# EAGLE design Thermostat (EAGLE 9.6.2)
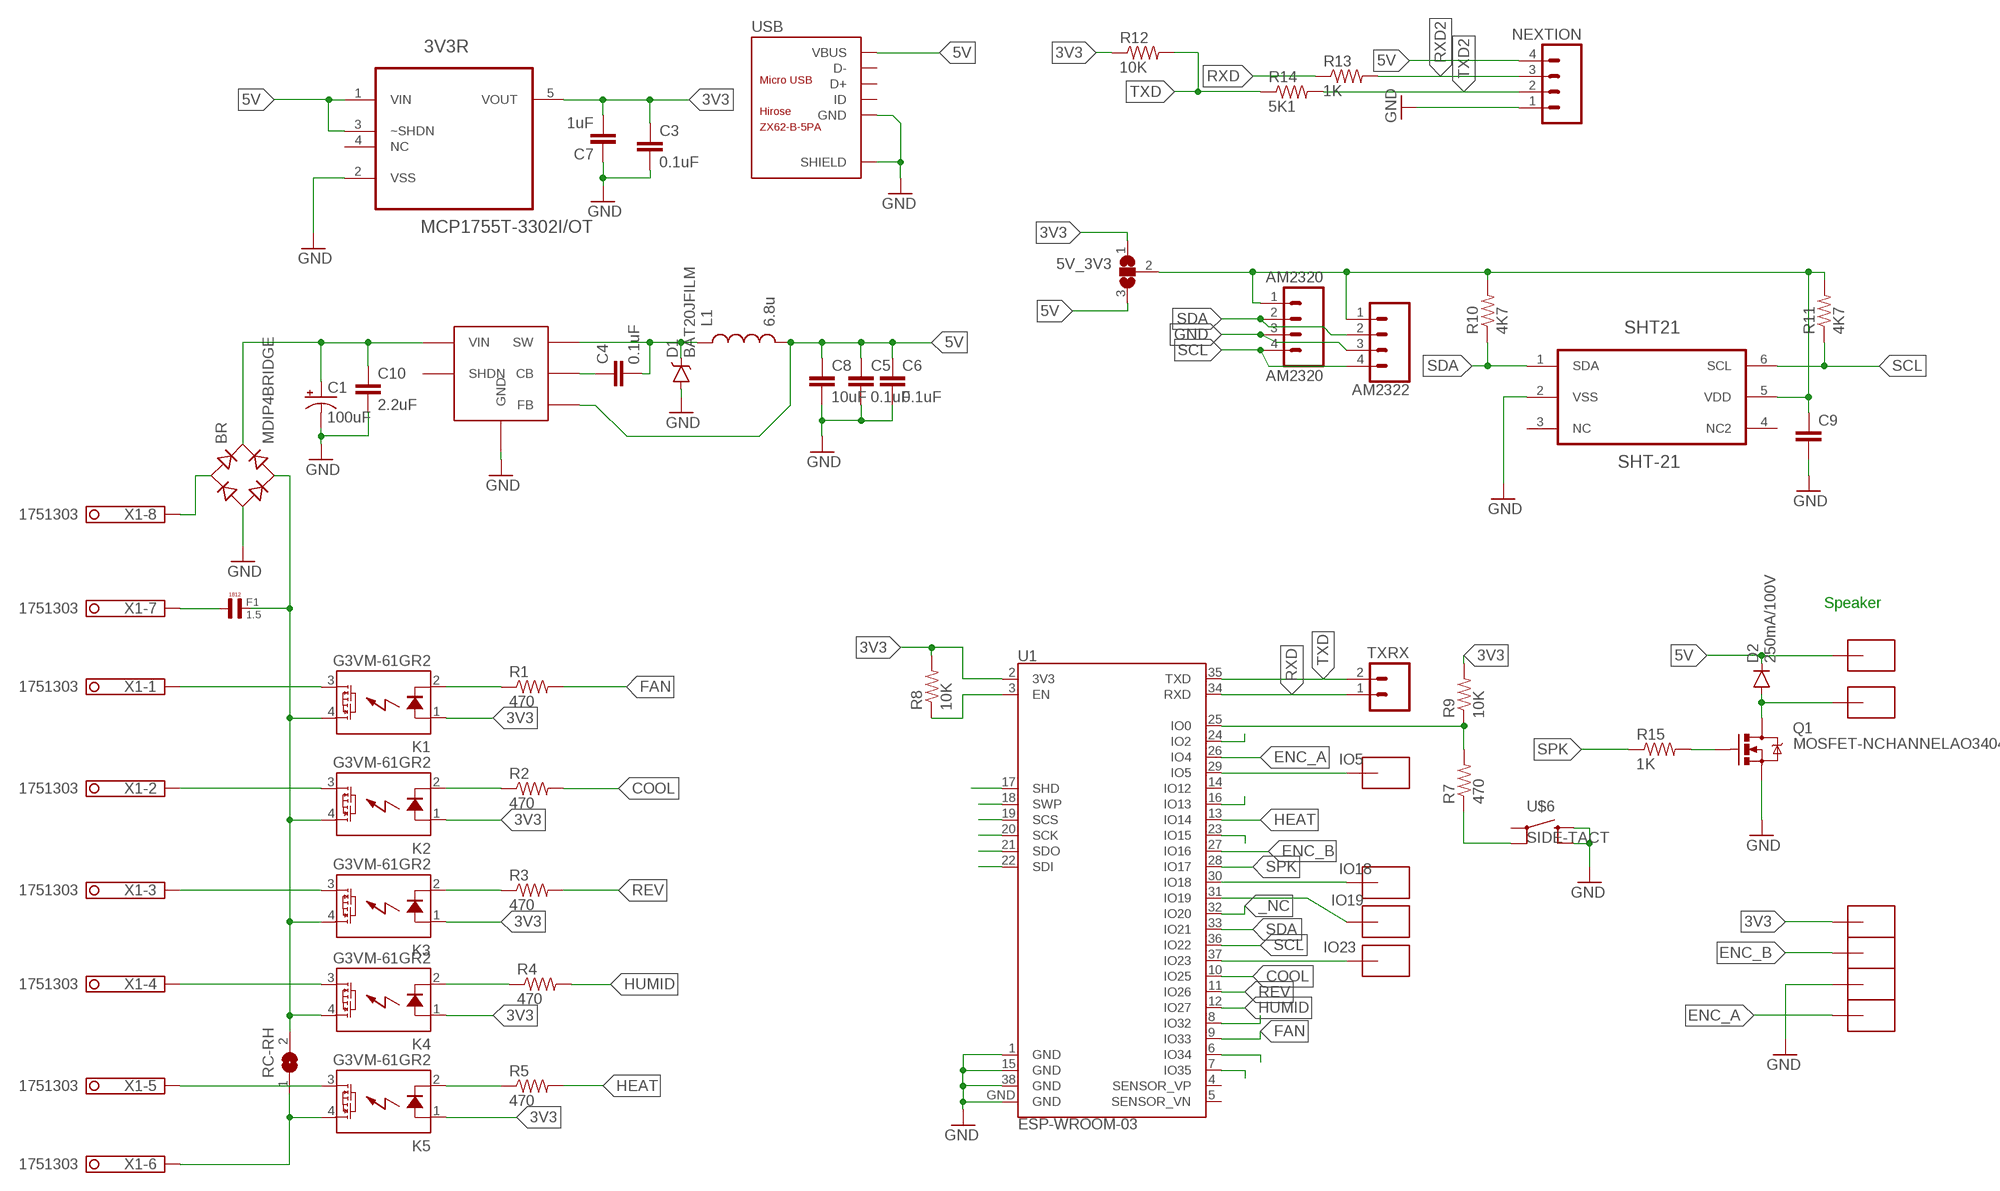
[diagram p0: schematic, sheet 1]

## Parts
3V3R  MCP1755T-3302I/OT  MCP1801T-3302I/OT  [SOT95P270X145-5N]
5V_3V3  SJ2W  [SJ_2]
AM2320  AM2320  M04PTH  [1X04]
AM2322  CONN_041.27MM  [1X04_1.27MM]
BR  MDIP4BRIDGE  [MICRODIP4]
C1  100uF  CAP_POLC  [PANASONIC_C]
C3  0.1uF  CAP0805  [0805]
C4  0.1uF  CAP0805  [0805]
C5  0.1uF  CAP0805  [0805]
C6  0.1uF  CAP0805  [0805]
C7  1uF  CAP0805  [0805]
C8  10uF  CAP0805  [0805]
C9  CAP0603-CAP  [0603-CAP]
C10  2.2uF  CAP0805  [0805]
D1  BAT20JFILM  [SOD-323]
D2  250mA/100V  DIODEBAS16  [SOD-323]
F1  1.5  0,1µF  [L4,8]
K1  G3VM-61GR2  AQY22SOP  [SOP04]
K2  G3VM-61GR2  AQY22SOP  [SOP04]
K3  G3VM-61GR2  AQY22SOP  [SOP04]
K4  G3VM-61GR2  AQY22SOP  [SOP04]
K5  G3VM-61GR2  AQY22SOP  [SOP04]
L1  6.8u  INDUCTOR1007  [1007]
NEXTION  M04PTH  [1X04]
Q1  MOSFET-NCHANNELAO3404A  [SOT23-3]
R1  470  RESISTOR0805-RES  [0805]
R2  470  RESISTOR0805-RES  [0805]
R3  470  RESISTOR0805-RES  [0805]
R4  470  RESISTOR0805-RES  [0805]
R5  470  RESISTOR0805-RES  [0805]
R7  470  RESISTOR0805-RES  [0805]
R8  10K  RESISTOR0805-RES  [0805]
R9  10K  RESISTOR0805-RES  [0805]
R10  4K7  RESISTOR0805-RES  [0805]
R11  4K7  RESISTOR0805-RES  [0805]
R12  10K  RESISTOR0805-RES  [0805]
R13  1K  RESISTOR0805-RES  [0805]
R14  5K1  RESISTOR0805-RES  [0805]
R15  1K  RESISTOR0805-RES  [0805]
RC-RH  SJ  [SJ]
SHT21  SHT-21  [SHT21]
TXRX  M02PTH  [1X02]
U1  ESP-WROOM-03  [ESP-WROOM-03]
U$1  SMD-PAD182X64  [SMD-PAD1]
U$2  SMD-PAD182X64  [SMD-PAD1]
U$3  SMD-PAD182X64  [SMD-PAD1]
U$4  SMD-PAD182X64  [SMD-PAD1]
U$5  SMD-PAD1SMD-PAD80X32  [SMD-PAD6]
U$6  SIDE-TACT  [SIDE-TACT]
U$7  SMD-PAD1SMD-PAD80X32  [SMD-PAD6]
U$8  SMD-PAD1SMD-PAD80X32  [SMD-PAD6]
U$9  SMD-PAD1SMD-PAD80X32  [SMD-PAD6]
U$10  SMD-PAD1SMD-PAD80X32  [SMD-PAD6]
U$11  SMD-PAD1SMD-PAD80X32  [SMD-PAD6]
USB  ZX62-B-5PA  MICRO-USB-SMD(ZX62-B-5PA)  [MICRO-USB5+6P-SMD-0.65-AB]
VREG  LMR16006YQ  [SOT-23-6]
X1  1751303  [1751303]

## Nets
3V3: 3V3R.5(VOUT) 5V_3V3.1 C3.1 C7.2 K1.1(A) K2.1(A) K3.1(A) K4.1(A) K5.1(A) R8.2 R9.2 R12.1 U1.2(3V3) U$7.>PAD
5V: 3V3R.1(VIN) 3V3R.3(~SHDN) 5V_3V3.3 C5.1 C6.1 C8.1 D2.C L1.2 NEXTION.4 U$5.>PAD USB.1(VBUS) VREG.3(FB)
_NC: U1.32(IO20)
COOL: R2.2 U1.10(IO25)
ENC_A: U1.26(IO4) U$10.>PAD
ENC_B: U1.27(IO16) U$8.>PAD
FAN: R1.2 U1.9(IO33)
GND: 3V3R.2(VSS) AM2320.3 AM2322.3 BR.- C1.- C3.2 C5.2 C6.2 C7.1 C8.2 C9.2 C10.2 D1.A NEXTION.1 Q1.2(S) SHT21.2(VSS) U1.1(GND) U1.15(GND) U1.38(GND) U1.GND U$6.3 U$6.4 U$9.>PAD USB.5(GND) USB.P1(SHIELD) USB.P2(SHIELD) USB.P3(SHIELD) USB.P4(SHIELD) USB.P5(SHIELD) USB.P6(SHIELD) VREG.2(GND)
HEAT: R5.2 U1.13(IO14)
HUMID: R4.2 U1.12(IO27)
IO5: U1.29(IO5) U$3.>PAD
IO18: U1.30(IO18) U$4.>PAD
IO19: U1.31(IO19) U$1.>PAD
IO23: U1.37(IO23) U$2.>PAD
N$1: U1.17(SHD)
N$2: C4.2 D1.C L1.1 VREG.6(SW)
N$3: BR.AC2 F1.P$2 K1.4(DS1) K2.4(DS1) K3.4(DS1) K4.4(DS1) RC-RH.2
N$4: K4.2(K) R4.1
N$6: Q1.1(G) R15.2
N$7: K3.2(K) R3.1
N$9: R8.1 U1.3(EN)
N$10: K2.2(K) R2.1
N$11: K4.3(DS2) X1.4
N$13: K2.3(DS2) X1.2
N$14: R7.2 R9.1 U1.25(IO0)
N$15: K1.3(DS2) X1.1
N$16: K1.2(K) R1.1
N$17: C4.1 VREG.1(CB)
N$18: K5.3(DS2) X1.5
N$20: BR.AC1 X1.8
N$22: K5.4(DS1) RC-RH.1 X1.6
N$23: F1.P$1 X1.7
N$24: BR.+ C1.+ C10.1 VREG.5(VIN)
N$25: K5.2(K) R5.1
N$26: U1.18(SWP)
N$27: R7.1 U$6.2
N$29: K3.3(DS2) X1.3
N$30: U1.19(SCS)
N$31: U1.20(SCK)
N$32: U1.21(SDO)
N$33: U1.22(SDI)
N$35: U1.24(IO2)
N$36: U1.16(IO13)
N$37: U1.23(IO15)
N$39: D2.A Q1.3(D) U$11.>PAD
N$40: U1.8(IO32)
N$42: U1.6(IO34)
N$43: U1.7(IO35)
PWR: 5V_3V3.2 AM2320.1 AM2322.1 C9.1 R10.2 R11.2 SHT21.5(VDD)
REV: R3.2 U1.11(IO26)
RXD: R13.1 TXRX.1 U1.34(RXD)
RXD2: NEXTION.3 R13.2
SCL: AM2320.4 AM2322.4 R11.1 SHT21.6(SCL) U1.36(IO22)
SDA: AM2320.2 AM2322.2 R10.1 SHT21.1(SDA) U1.33(IO21)
SPK: R15.1 U1.28(IO17)
TXD: R12.2 R14.1 TXRX.2 U1.35(TXD)
TXD2: NEXTION.2 R14.2
Unconnected: 3V3R.4(NC) SHT21.4(NC2) U1.4(SENSOR_VP) U1.5(SENSOR_VN) U1.14(IO12) U$6.1 USB.2(D-) USB.3(D+) USB.4(ID) VREG.4(SHDN)

## Notes on the sheet
- Speaker

## Power pins joined to a net without a drawn wire
NC: SHT21.3(NC)

## Library data of the parts
3V3R = Microchip_By_element14_Batch_1:MCP1801T-3302I/OT: Low Quiescent Current LDO; MPN: MCP1801T-3302I/OT; OC_FARNELL: 1578370; OC_NEWARK: 54M4830; PACKAGE: SOT-5; SUPPLIER: Microchip
5V_3V3 = jumper:SJ2W: SMD solder JUMPER
AM2320 NEXTION = SparkFun-Connectors:M04: Header 4 Standard 4-pin 0.1" header. Use with straight break away headers (SKU : PRT-00116), right angle break away headers (PRT-00553), swiss pins (PRT-00743), machine pins (PRT-00117), and female headers (PRT-00115). Molex polarized connector foot print use with SKU : PRT-08231 with associated crimp pins and housings. 1MM SMD Version SKU: PRT-10208; PROD_ID: CONN-09696
AM2322 = SparkFun-Connectors:CONN_04: Multi connection point. Often used as Generic Header-pin footprint for 0.1 inch spaced/style header connections On any of the 0.1 inch spaced packages, you can populate with these: Break Away Headers - Straight <https://www.sparkfun.com/products/116> (PRT-00116) Break Away Male Headers - Right Angle <https://www.sparkfun.com/products/553> (PRT-00553) Female Headers <https://www.sparkfun.com/products/115> (PRT-00115) Break Away Headers - Machine Pin <https://www.sparkfun.com/products/117> (PRT-00117) Break Away Female Headers - Swiss Machine Pin <https://www.sparkfun.com/products/743> (PRT-00743) For SCREWTERMINALS and SPRING TERMINALS visit here: Screw Terimnals on SparkFun.com <https://www.sparkfun.com/search/results?term=Screw+Terminals> (5mm/3.5mm/2.54mm spacing) This device is also useful as a general connection point to wire up your design to another part of your project. Our various solder wires solder well into these plated through hole pads. Hook-Up Wire - Assortment (Stranded, 22 AWG) <https://www.sparkfun.com/products/11375> (PRT-11375) Hook-Up Wire - Assortment (Solid Core, 22 AWG) <https://www.sparkfun.com/products/11367> (PRT-11367) View the entire wire category on our website here <https://www.sparkfun.com/categories/141> Special notes: Molex polarized connector foot print use with SKU : PRT-08231 with associated crimp pins and housings. 1MM SMD Version SKU: PRT-10208
BR = CuriousTech:MDIP4BRIDGE
C1 = SparkFun-Capacitors:CAP_POL: Capacitor Polarized These are standard SMD and PTH capacitors. Normally 10uF, 47uF, and 100uF in electrolytic and tantalum varieties. Always verify the external diameter of the through hole cap, it varies with capacity, voltage, and manufacturer. The EIA devices should be standard.
C3-C10 = SparkFun-Capacitors:CAP: Capacitor Standard 0603 ceramic capacitor, and 0.1" leaded capacitor.
D1 = SparkFun-DiscreteSemi:BAT20JFILM: 23V, 1A Schottky diode, SOD-323 package; PROD_ID: DIO-11623
D2 = SparkFun-DiscreteSemi:DIODE: Diode These are standard reverse protection diodes and small signal diodes. SMA package can handle up to about 1A. SOD-323 can handle about 200mA. What the SOD-323 package when ordering, there are some mfgs out there that are 5-pin packages.; PROD_ID: DIO-09646
F1 = Capacitor-Wima-SMD1812-100v:0,1µF
K1-K5 = relay:AQY*: PhotoMOS Relay NAiS Source: http://www.panasonic-electric-works.com/catalogues/downloads/photomos/ds_x615_en_aqz10_20.pdf; OC_FARNELL: unknown; OC_NEWARK: unknown
L1 = SparkFun-Passives:INDUCTOR: Inductors Basic Inductor/Choke - 0603 and 1206. Footprints are not proven and vary greatly between part numbers. INDUCTOR POWER 3.3UH 4.0A SMD 0.197" L x 0.197" W x 0.177" H (5.00mm x 5.00mm x 4.50mm)
Q1 = SparkFun-DiscreteSemi:MOSFET-NCHANNEL: Common NMOSFET Parts MFG P/N Store ID Prod ID FDD8780 TRANS-09984 SI7820DN TRANS-11055 FDS6630A IC-08089 2N7002PW TRANS-11151 FQP30N06L COM-10213 TRANS-10060 BSS123LT1G TRANS-08345 BSS138 TRANS-00830 BS170 2N7000; PROD_ID: TRAN-12988
R1-R5 R9 = SparkFun-Passives:RESISTOR: Resistor Basic schematic elements and footprints for 0603, 1206, and PTH resistors.
R7 R8 R10-R15 = SparkFun-Resistors:RESISTOR: Resistor Basic schematic elements and footprints for 0603, 1206, and PTH resistors.
RC-RH = jumper:SJ: SMD solder JUMPER
SHT21 = CuriousTech:SHT-21
TXRX = SparkFun-Connectors:M02: Standard 2-pin 0.1" header. Use with - straight break away headers ( PRT-00116) - right angle break away headers (PRT-00553) - swiss pins (PRT-00743) - machine pins (PRT-00117) - female headers (PRT-00115) Molex polarized connector foot print use with: PRT-08233 with associated crimp pins and housings. 2.54_SCREWTERM for use with PRT-10571. 3.5mm Screw Terminal footprints for PRT-08084 5mm Screw Terminal footprints for use with PRT-08432
U1 = esp32:ESP-WROOM-03
U$1-U$5 U$7-U$11 = CuriousTech:SMD-PAD1: SMD-PAD small
U$6 = CuriousTech:SIDE-TACT
USB = Seeed-OPL-Connector:MICRO-USB-SMD(ZX62-B-5PA): 320010005; MPN: ZX62-B-5PA
VREG = CuriousTech:LMR16006YQ
X1 = con-phoenix-350:1751303: MKDS 1/ 8-3,5 Printklemme Nennstrom: 10 A Bemessungsspannung: 160 V Raster: 3,5 mm Polzahl: 8 Montageart: Löten Anschlussart: Schraubanschluss Anschlussrichtung vom Leiter zur Platine: 0° Source: http://eshop.phoenixcontact.com .. .pdf; OC_FARNELL: unknown; OC_NEWARK: unknown

## Board
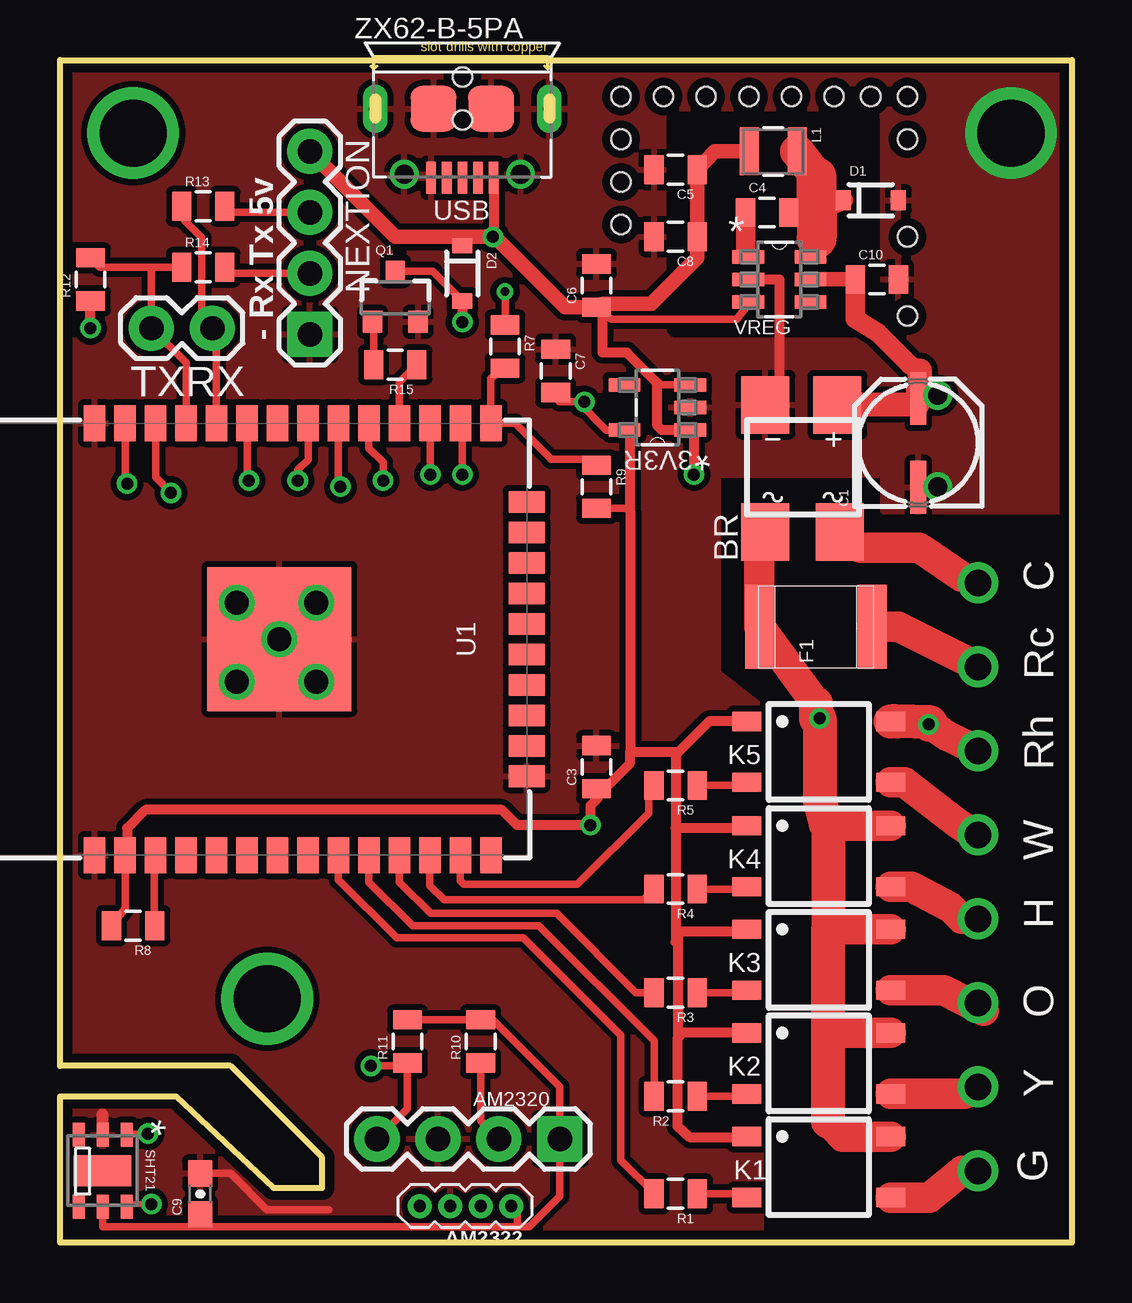
[diagram p1: board, top side]
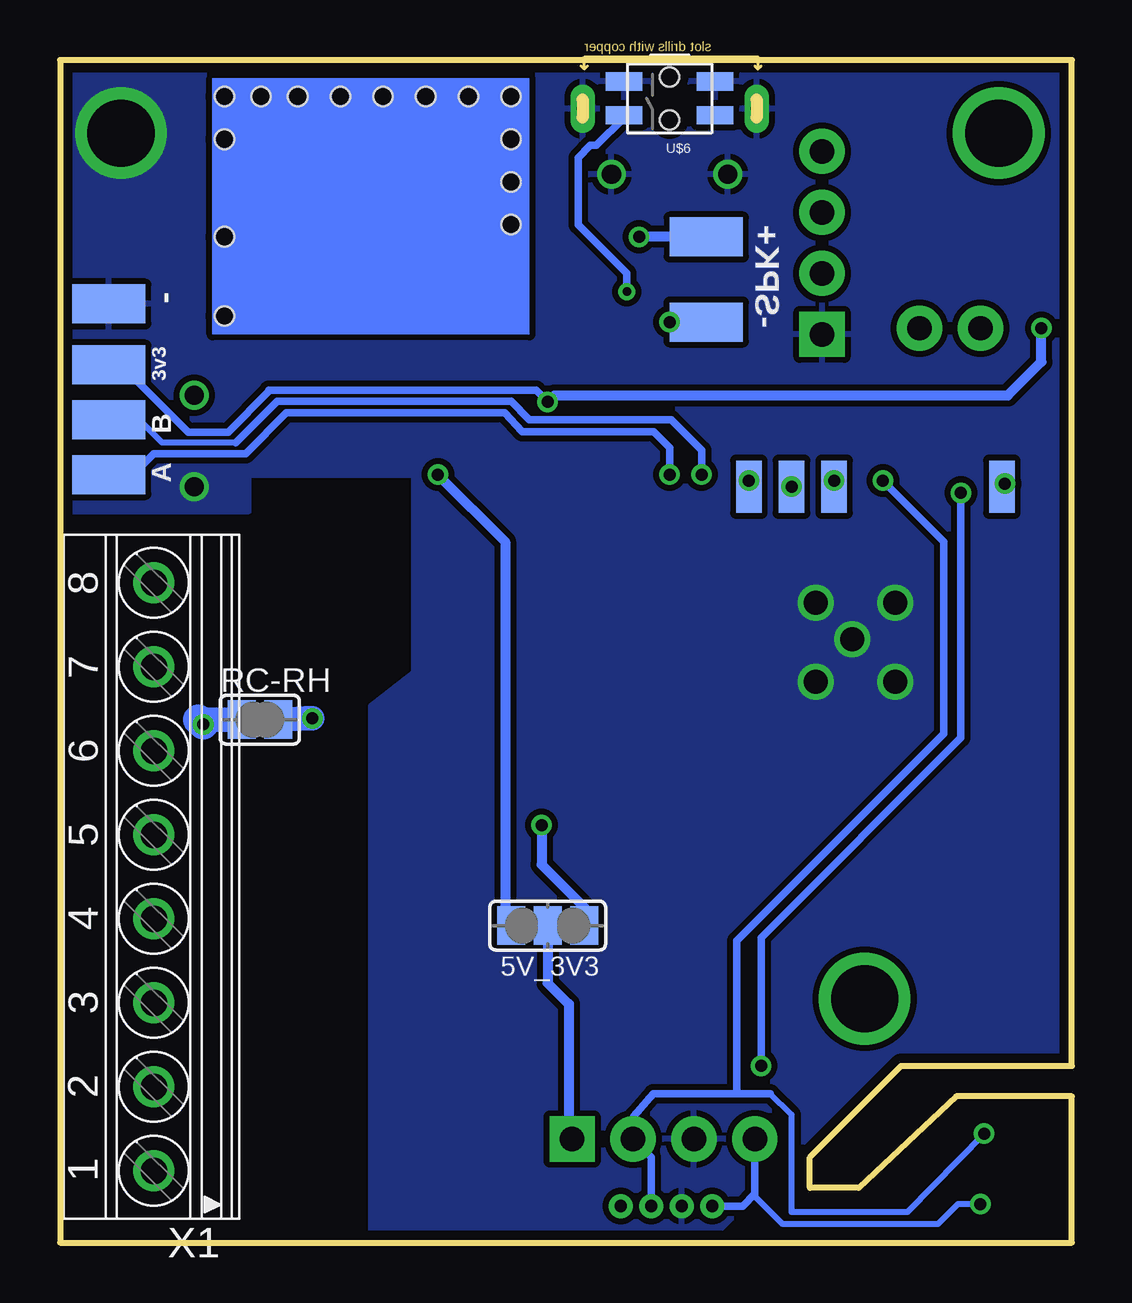
[diagram p2: board, bottom side, seen from below]

Size 42.16 x 49.28 mm. Coordinates in mm from the lower left corner, seen from the top.
Outline: 42.16,0 0,0 0,6.1 4.83,6.1 8.89,2.29 10.92,2.29 10.92,3.56 7.11,7.37 0,7.37 0,49.28 42.16,49.28 42.16,0
Copper layers (1*16): Top 0.0356mm / dielectric 1.5011mm / Bottom 0.0356mm
Design rules "LaenPCBOrder": minimum track width 6mil, minimum drill 13mil, track to track 6mil, track to pad 6mil, pad to pad 6mil, via to via 6mil, smd to smd 6mil, copper to edge 15mil, drill to drill 6mil, minimum pad ring 7mil, minimum via ring 7mil, stop-mask expansion 4mil, vias tented up to drill 0mil, thermal gap 10mil
Holes 0.8 mm at 23.37,42.42 23.37,44.2 23.37,45.97 23.37,47.75 25.15,47.75 26.92,47.75 28.7,47.75 30.48,47.75 32.26,47.75 33.78,47.75 35.31,47.75 35.31,45.97 35.31,41.91 35.31,38.61
tRestrict: area 25.7,38.1 to 33.8,46.7

### Footprints (pad centres in the part's own frame; a part is rotated, then mirrored left to right if it is on the bottom)
SOT95P270X145-5N = smd 1.321 x 0.559: 1 -1.372,0.94; 2 -1.372,0; 3 -1.372,-0.94; 4 1.372,-0.94; 5 1.372,0.94
SJ_2 = smd 1.168 x 1.6: 1 -1.524,0; 2 0,0; 3 1.524,0
1X04 = drill 1.016 pad 1.88 square: 1 0,0 | drill 1.016 pad 1.88: 2 2.54,0; 3 5.08,0; 4 7.62,0
1X04_1.27MM = drill 0.508 pad 1: 1 0,0; 2 1.27,0; 3 2.54,0; 4 3.81,0
MICRODIP4 = smd 2 x 2.4: + -1.4,-2.65; - 1.6,-2.65; AC1 -1.5,2.65; AC2 1.6,2.65
PANASONIC_C = smd 2.2 x 0.65: + 1.9,-0.2; - -1.8,-0.2
0805 = smd 0.8 x 1.2: 1 -0.9,0; 2 0.9,0
0603-CAP = smd 1.1 x 1: 1 -0.85,0; 2 0.85,0
SOD-323 = smd 0.63 x 0.83: A 1.15,0; C -1.15,0
L4,8 = smd 3.5 x 1.2: P$1 0,-2.35; P$2 0,2.35
SOP04 = smd 0.8 x 1.2: 1 -1.27,-3; 2 1.27,-3; 3 1.27,3; 4 -1.27,3
1007 = smd 2 x 0.8: 1 0,1; 2 0,-1
SOT23-3 = smd 0.8 x 0.9: 1 -0.95,-1; 2 0.95,-1; 3 0,1.1
SJ = smd 1.168 x 1.6: 1 -0.762,0; 2 0.762,0
SHT21 = smd 1 x 0.5: 1 -1.5,1; 2 -1.5,0; 3 -1.5,-1; 4 1.5,-1; 5 1.5,0; 6 1.5,1 | smd 1.3 x 2.4: P$1 0,0
1X02 = drill 1.016 pad 1.88: 1 0,0; 2 2.54,0
ESP-WROOM-03 = smd 0.9 x 1.5: 1 7.7,9; 2 6.43,9; 3 5.16,9; 4 3.89,9; 5 2.62,9; 6 1.35,9; 7 0.08,9; 8 -1.19,9; 9 -2.46,9; 10 -3.73,9; 11 -5,9; 12 -6.27,9; 13 -7.54,9; 14 -8.81,9; 25 -8.81,-9; 26 -7.54,-9; 27 -6.27,-9; 28 -5,-9; 29 -3.73,-9; 30 -2.46,-9; 31 -1.19,-9; 32 0.08,-9; 33 1.35,-9; 34 2.62,-9; 35 3.89,-9; 36 5.16,-9; 37 6.43,-9; 38 7.7,-9 | smd 1.5 x 0.9: 15 -10.3,5.715; 16 -10.3,4.445; 17 -10.3,3.175; 18 -10.3,1.905; 19 -10.3,0.635; 20 -10.3,-0.635; 21 -10.3,-1.905; 22 -10.3,-3.175; 23 -10.3,-4.445; 24 -10.3,-5.715 | smd 6 x 6: GND 0,0
SMD-PAD1 = smd 2.184 x 1.067: >PAD 0,0
SMD-PAD6 = smd 3.048 x 1.626: >PAD 0,0
SIDE-TACT = smd 1.524 x 0.762: 1 -1.894,0.705; 2 1.894,0.705; 3 -1.894,-0.705; 4 1.894,-0.705 | hole 0.8: 0,0.9; 0,-0.9
MICRO-USB5+6P-SMD-0.65-AB = smd 0.4 x 1.35: 1 -1.3,2.875; 2 -0.65,2.875; 3 0,2.875; 4 0.65,2.875; 5 1.3,2.875 | smd 1.9 x 1.9: P1 -1.2,0; P2 1.2,0 | drill 0.508 pad 1.016 long: P3 -3.625,0; P4 3.625,0 | drill 0.8: P5 -2.425,2.73; P6 2.425,2.73
SOT-23-6 = smd 1.321 x 0.559: 1 -1.295,0.94; 2 -1.295,0; 3 -1.295,-0.94; 4 1.295,-0.94; 5 1.295,0; 6 1.295,0.94
1751303 = drill 1.1 pad 1.7: 1 -12.25,-0.1; 2 -8.75,-0.1; 3 -5.25,-0.1; 4 -1.75,-0.1; 5 1.75,-0.1; 6 5.25,-0.1; 7 8.75,-0.1; 8 12.25,-0.1

### Placement (x,y rotation side)
3V3R  24.89,34.8 180 top
5V_3V3  21.84,13.21 180 bottom
AM2320  20.83,4.32 180 top
AM2322  18.8,1.52 180 top
BR  30.99,32.26 180 top
C1  35.56,33.27 90 top
C3  22.35,19.81 90 top
C4  29.46,42.93 0 top
C5  25.65,44.7 180 top
C6  22.35,39.88 90 top
C7  20.65,36.32 270 top
C8  25.65,41.91 180 top
C9  5.84,2.03 90 top
C10  34.04,40.13 0 top
D1  33.78,43.43 0 top
D2  16.76,40.39 270 top
F1  31.5,25.65 90 top
K1  31.61,3.15 270 top
K2  31.61,7.47 270 top
K3  31.61,11.78 270 top
K4  31.61,16.1 270 top
K5  31.61,20.45 270 top
L1  29.72,45.47 270 top
NEXTION  10.41,37.85 90 top
Q1  13.97,39.37 0 top
R1  25.65,2.03 180 top
R2  25.65,6.1 180 top
R3  25.65,10.41 180 top
R4  25.65,14.73 180 top
R5  25.65,19.05 180 top
R7  18.54,37.34 270 top
R8  3.05,13.21 180 top
R9  22.35,31.5 270 top
R10  17.53,8.38 90 top
R11  14.48,8.38 90 top
R12  1.27,40.13 90 top
R13  5.97,43.18 0 top
R14  5.97,40.64 0 top
R15  13.97,36.58 180 top
RC-RH  33.84,21.79 0 bottom
SHT21  1.78,3 270 top
TXRX  6.35,38.1 180 top
U1  9.14,25.15 180 top
U$1  9.91,31.5 270 bottom
U$2  2.92,31.5 270 bottom
U$3  13.46,31.5 270 bottom
U$4  11.68,31.5 270 bottom
U$5  15.24,41.91 0 bottom
U$6  16.76,47.68 180 bottom
U$7  40.13,36.58 0 bottom
U$8  40.13,34.29 0 bottom
U$9  40.13,39.12 0 bottom
U$10  40.13,32 0 bottom
U$11  15.24,38.35 0 bottom
USB  16.76,47.24 180 top
VREG  29.97,40.13 0 top
X1  38.35,15.24 90 bottom

### Tracks (layer width: path | path; a pad name or v marks a point on that pad's centre or on a via)
3V3  (via drill 0.5)
  Top 0.305: v21.84,35.03 21.59,35.03 | 21.59,35.03 20.8,35.03 C7.2 | U1.2 2.71,13.93 R8.2 | 23.68,33.86 3V3R.5 22.76,33.86 21.59,35.03 | R9.2 23.64,30.6 23.76,30.48
  Top 0.406: 23.68,33.86 23.76,33.78 23.76,30.48 23.76,20.45 | v1.27,38.1 R12.1 | U1.2 2.71,16.18 2.79,16.26 2.79,17.27 3.56,18.03 18.41,18.03 19.05,17.4 v22.1,17.4 22.1,18.21 22.39,18.5 22.39,18.87 C3.1 22.69,18.91 23.76,19.98 23.76,20.45 | K1.1 28.57,4.38 26.26,4.38 25.73,4.84 25.73,8.51 | 25.73,8.51 25.95,8.74 K2.1 | K3.1 28.51,12.95 25.91,12.95 25.73,12.78 25.73,12.45 | 25.73,12.45 25.73,8.51 | K4.1 28.51,17.27 25.65,17.27 | 25.65,17.27 25.65,12.52 25.73,12.45 | K5.1 27.05,21.72 25.78,20.45 | 25.78,20.45 25.65,20.32 25.65,17.27 | 23.76,20.45 25.78,20.45
  Bottom 0.305: v21.84,35.03 22.32,35.51 33.46,35.51 33.46,35.47 35.16,33.77 36.83,33.77 39.14,36.08 39.64,36.08 U$7.>PAD
  Bottom 0.406: v1.27,38.1 1.27,36.7 2.67,35.31 21.57,35.31 v21.84,35.03 | 5V_3V3.1 20.32,13.97 22.1,15.75 v22.1,17.4
5V  (via drill 0.5)
  Top 0.305: VREG.3 28.63,39.04 28.19,38.48 22.99,38.48 22.35,38.86 | 3V3R.3 24.89,35.74 | D2.C 16.76,41.91 | 3V3R.1 26.42,33.71 26.42,33.78
  Top 0.406: C6.1 22.35,38.86 | 18.06,41.96 USB.1 18.06,41.91 | 26.42,33.78 v26.42,32 | 3V3R.1 25.07,33.86 24.89,34.04 24.89,35.74 24.89,35.81 23.62,37.08 22.61,37.08 22.61,39.12 | v18.03,41.91 17.02,41.91 16.9,41.79 16.9,41.67 D2.C
  Top 0.61: L1.2 27.28,45.48 C5.1 C8.1 26.55,41.03 24.64,39.12 22.61,39.12 22.35,38.86 | NEXTION.4 13.97,41.91 16.76,41.91 v18.03,41.91 18.06,41.91 | C6.1 21.04,38.98 18.06,41.96
  Bottom 0.406: v26.42,32 23.62,29.21 23.62,13.46 5V_3V3.3 | U$5.>PAD v18.03,41.91
COOL
  Top 0.305: R2.2 24.75,8.41 19.96,13.21 14.69,13.21 12.87,15.02 U1.10
ENC_A  (via drill 0.5)
  Top 0.305: U1.26 16.79,34.04 16.76,33.78 v16.76,32
  Bottom 0.305: v16.76,32 16.76,33.11 17.43,33.78 22.89,33.78 23.63,34.57 32.74,34.57 34.43,32.88 38.25,32.88 39.13,32 U$10.>PAD
ENC_B  (via drill 0.5)
  Top 0.305: U1.27 15.43,34.13 v15.43,32
  Bottom 0.254: 34.83,33.34 37.91,33.34 38.86,34.29 U$8.>PAD
  Bottom 0.305: v15.43,32 15.43,33.02 16.7,34.29 22.61,34.29 23.37,35.05 33.12,35.05 34.83,33.34
FAN
  Top 0.305: R1.2 24.75,2.05 23.37,3.44 23.37,8.64 19.3,12.7 14.03,12.7 11.6,15.13 U1.9
GND  (via drill 0.8, 1, 2.8)
  Top 0.305: C9.2 7.11,2.88 8.62,1.37 11.2,1.37
  Top 0.406: VREG.2 29.97,40.13 29.97,35.49 BR.-
  Top 0.508: SHT21.2 1.78,5.33
  other vias: 36.58,31.5 9.14,25.15 7.37,26.67 7.37,23.37 10.67,23.37 10.67,26.67 39.62,46.23
  pour Top (isolate 0.254): 0,1.27 13.97,1.27 15.24,0 29.21,0 29.21,22.35 27.43,23.73 27.43,32 34.29,32 34.29,30.48 42.16,30.48 42.16,49.28 0,49.28
  pour Bottom (isolate 0.254): 42.16,30.48 34.29,30.48 34.29,32 27.43,32 27.43,23.73 29.21,22.35 29.21,0.25 28.96,0 15.22,0 7.6,7.37 0,7.37 0,49.28 42.16,49.28
HEAT
  Top 0.305: R5.2 24.53,18.82 24.53,17.9 21.55,14.93 16.83,14.93 16.73,15.02 16.68,15.07 U1.13
HUMID
  Top 0.305: R4.2 24.3,14.28 16.01,14.28 15.41,14.88 U1.12
IO5  (via drill 0.5)
  Top 0.305: U1.29 12.87,33.1 13.46,32.51 v13.46,31.75
  Bottom 0.305: U$3.>PAD v13.46,31.75
IO18  (via drill 0.5)
  Top 0.305: U1.30 11.6,31.83 11.68,31.75 U$4.>PAD
  other vias: 11.68,31.5
IO19  (via drill 0.5)
  Top 0.305: U1.31 10.33,32.62 9.91,32.19 v9.91,31.75
  Bottom 0.305: v9.91,31.75 U$1.>PAD
IO23  (via drill 0.5)
  Top 0.305: U1.37 2.71,31.67 v2.79,31.62
  Bottom 0.305: U$2.>PAD 2.92,31.62 v2.79,31.62
N$2
  Top 0.61: 31.52,41.85 31.27,41.83 VREG.6
  Top 0.813: D1.C 31.52,42.93 C4.2
  Top 1.422: 31.52,44.41 L1.1
  Top 1.676: 31.52,44.41 31.52,42.93 31.52,41.85
N$3  (via drill 0.5)
  Top 0.406: 32,17.37 31.9,17.47
  Top 1.27: K3.4 32,13.05 | K1.4 32.61,4.42 32,5.05 | K2.4 32,8.74 | K4.4 32,17.37 | 31.5,22.47 F1.P$2 29.13,25.66 29.13,29.18 29.39,29.45 BR.AC2
  Top 1.422: 32,5.05 32,8.74 32,13.05 32,17.37 | 31.5,22.47 31.5,21.84 v31.65,21.84 31.65,18.5 31.9,17.47
  Bottom 1.016: RC-RH.2 31.9,21.84 v31.65,21.84
N$4
  Top 0.305: K4.2 28.51,14.73 R4.1
N$5  (via drill 2.8)
  other vias: 8.64,10.16
N$6
  Top 0.305: R15.2 13.07,38.32 Q1.1
N$7
  Top 0.305: R3.1 28.51,10.41 K3.2
N$8  (via drill 2.8)
  other vias: 3.05,46.23
N$9
  Top 0.305: R8.1 3.93,13.22 3.93,15.42 3.98,15.47 U1.3
N$10
  Top 0.305: R2.1 28.51,6.1 K2.2
N$11
  Top 1.27: K4.3 35.46,14.83 37.08,13.97 37.56,13.49 X1.4
N$13
  Top 1.27: X1.2 37.71,6.2 K2.3
N$14
  Top 0.305: R7.2 17.95,36.02 U1.25 18.97,34.15 20.43,32.68 20.45,32.65 22.1,32.65 R9.1
N$15
  Top 1.27: K1.3 36.23,1.88 37.59,2.99 X1.1
N$16
  Top 0.305: R1.1 28.46,2.03 K1.2
N$17
  Top 0.406: VREG.1 28.56,41.18
  Top 0.813: 28.56,41.18 C4.1
N$18
  Top 1.27: K5.3 35.18,19.18 37.37,17.5 38.17,16.96 X1.5
N$20
  Top 1.27: BR.AC1 32.99,29.11 33.37,28.96 35.79,28.96 35.92,28.86 37.56,27.74 X1.8
N$22  (via drill 0.5)
  Top 1.016: 36.25,21.61 v36.2,21.59
  Top 1.27: 36.25,21.61 36.96,21.11 X1.6
  Top 1.422: K5.4 34.87,21.72 36.28,21.68 v36.2,21.59
  Bottom 1.016: RC-RH.1 36.4,21.79
  Bottom 1.27: 36.4,21.79 v36.2,21.59
N$23
  Top 1.27: X1.7 34.93,25.65 F1.P$1
N$24  (via drill 0.8)
  Top 0.406: v36.58,35.31 36.48,35.58 35.87,35.58 35.81,35.56 35.76,35.54
  Top 0.61: VREG.5 C10.1
  Top 0.813: 35.81,36.32 35.41,36.57 34.08,37.91 33.14,38.49 C10.1
  Top 1.016: BR.+ 32.76,34.91 32.77,34.91 35.71,34.92 C1.+ 35.76,35.54 | 35.81,35.56 35.81,36.32
N$25
  Top 0.305: K5.2 28.49,19.05 R5.1
N$27  (via drill 0.35)
  Top 0.305: R7.1 v18.54,39.62
  Bottom 0.305: v18.54,39.62 18.54,40.39 20.57,42.42 20.57,45.21 20.07,45.72 19.81,45.72 18.66,46.87 U$6.2
N$29
  Top 1.27: K3.3 36.81,10.51 38.49,9.66 X1.3
N$39  (via drill 0.5)
  Top 0.305: Q1.3 15.53,40.47 D2.A
  Top 0.406: D2.A v16.76,38.35
  Bottom 0.406: v16.76,38.35 U$11.>PAD
PWR
  Top 0.305: SHT21.5 1.78,0.66 5.59,0.66 | 5.59,0.66 19.05,0.66 | 19.05,0.66 19.56,0.66 20.83,1.93 AM2320.1 20.83,6.49 18.03,9.28 R10.2 R11.2 | C9.1 5.59,1.18 5.59,0.66 | AM2322.1 19.05,1.27 19.05,0.66
  Bottom 0.406: 5V_3V3.2 21.84,10.81 20.97,9.94 20.97,4.46 AM2320.1
REV
  Top 0.305: R3.2 23.99,10.41 20.69,13.72 15.45,13.72 14.14,15.02 U1.11
RXD
  Top 0.305: R13.1 5.2,42.58 5.9,41.87 5.9,38.55 TXRX.1 6.35,37.48 6.52,37.31 U1.34
RXD2
  Top 0.305: NEXTION.3 7.12,42.93 R13.2
SCL  (via drill 0.5)
  Top 0.254: v3.81,1.6 2.88,1.6 SHT21.6
  Top 0.305: AM2320.4 14.48,5.59 R11.1 14.36,7.37 v12.95,7.37 | v4.62,31.24 3.98,31.88 U1.36
  Bottom 0.254: v3.81,1.6 4.75,1.6 5.58,0.77 12.05,0.77 13.21,1.93
  Bottom 0.305: 13.21,1.93 AM2320.4 13.21,2.03 13.72,1.52 AM2322.4 | v4.62,31.24 4.62,21.03 12.95,12.7 v12.95,7.37
SDA  (via drill 0.5)
  Top 0.254: v3.66,4.55 2.83,4.55
  Top 0.305: U1.33 7.79,31.96 v7.87,31.75 | 2.83,4.55 SHT21.1 | R10.1 17.53,5.08 AM2320.2
  Bottom 0.254: v3.66,4.55 6.86,1.27 11.68,1.27 11.68,5.33 12.56,6.21
  Bottom 0.305: v7.87,31.75 5.33,29.21 5.33,21.21 13.97,12.57 13.97,6.21 | 12.56,6.21 13.97,6.21 | 13.97,6.21 17.45,6.21 18.25,5.27 18.25,4.36 AM2320.2 17.53,3.56 AM2322.2
SPK
  Top 0.305: U1.28 14.14,35.85 R15.1
TXD
  Top 0.305: R12.2 1.66,40.64 3.81,40.64 | 3.81,40.64 R14.1 | 3.81,40.64 TXRX.2 5.25,36.66 U1.35
TXD2
  Top 0.305: NEXTION.2 7.12,40.39 R14.2
(copper drawn outside any net)
  shapes: Bottom area x1

### Text on the board
tPlace: - Rx Tx 5v | C | Rc | Rh | W | H | O | Y | G
bNames: - | -SPK+ | 3v3 | B | A
bValues: 23 | 18 | 19 | 5
bStop: ESP32-HVAC | CuriousTech.net